# EAGLE design gdoor (EAGLE 9.2.2)
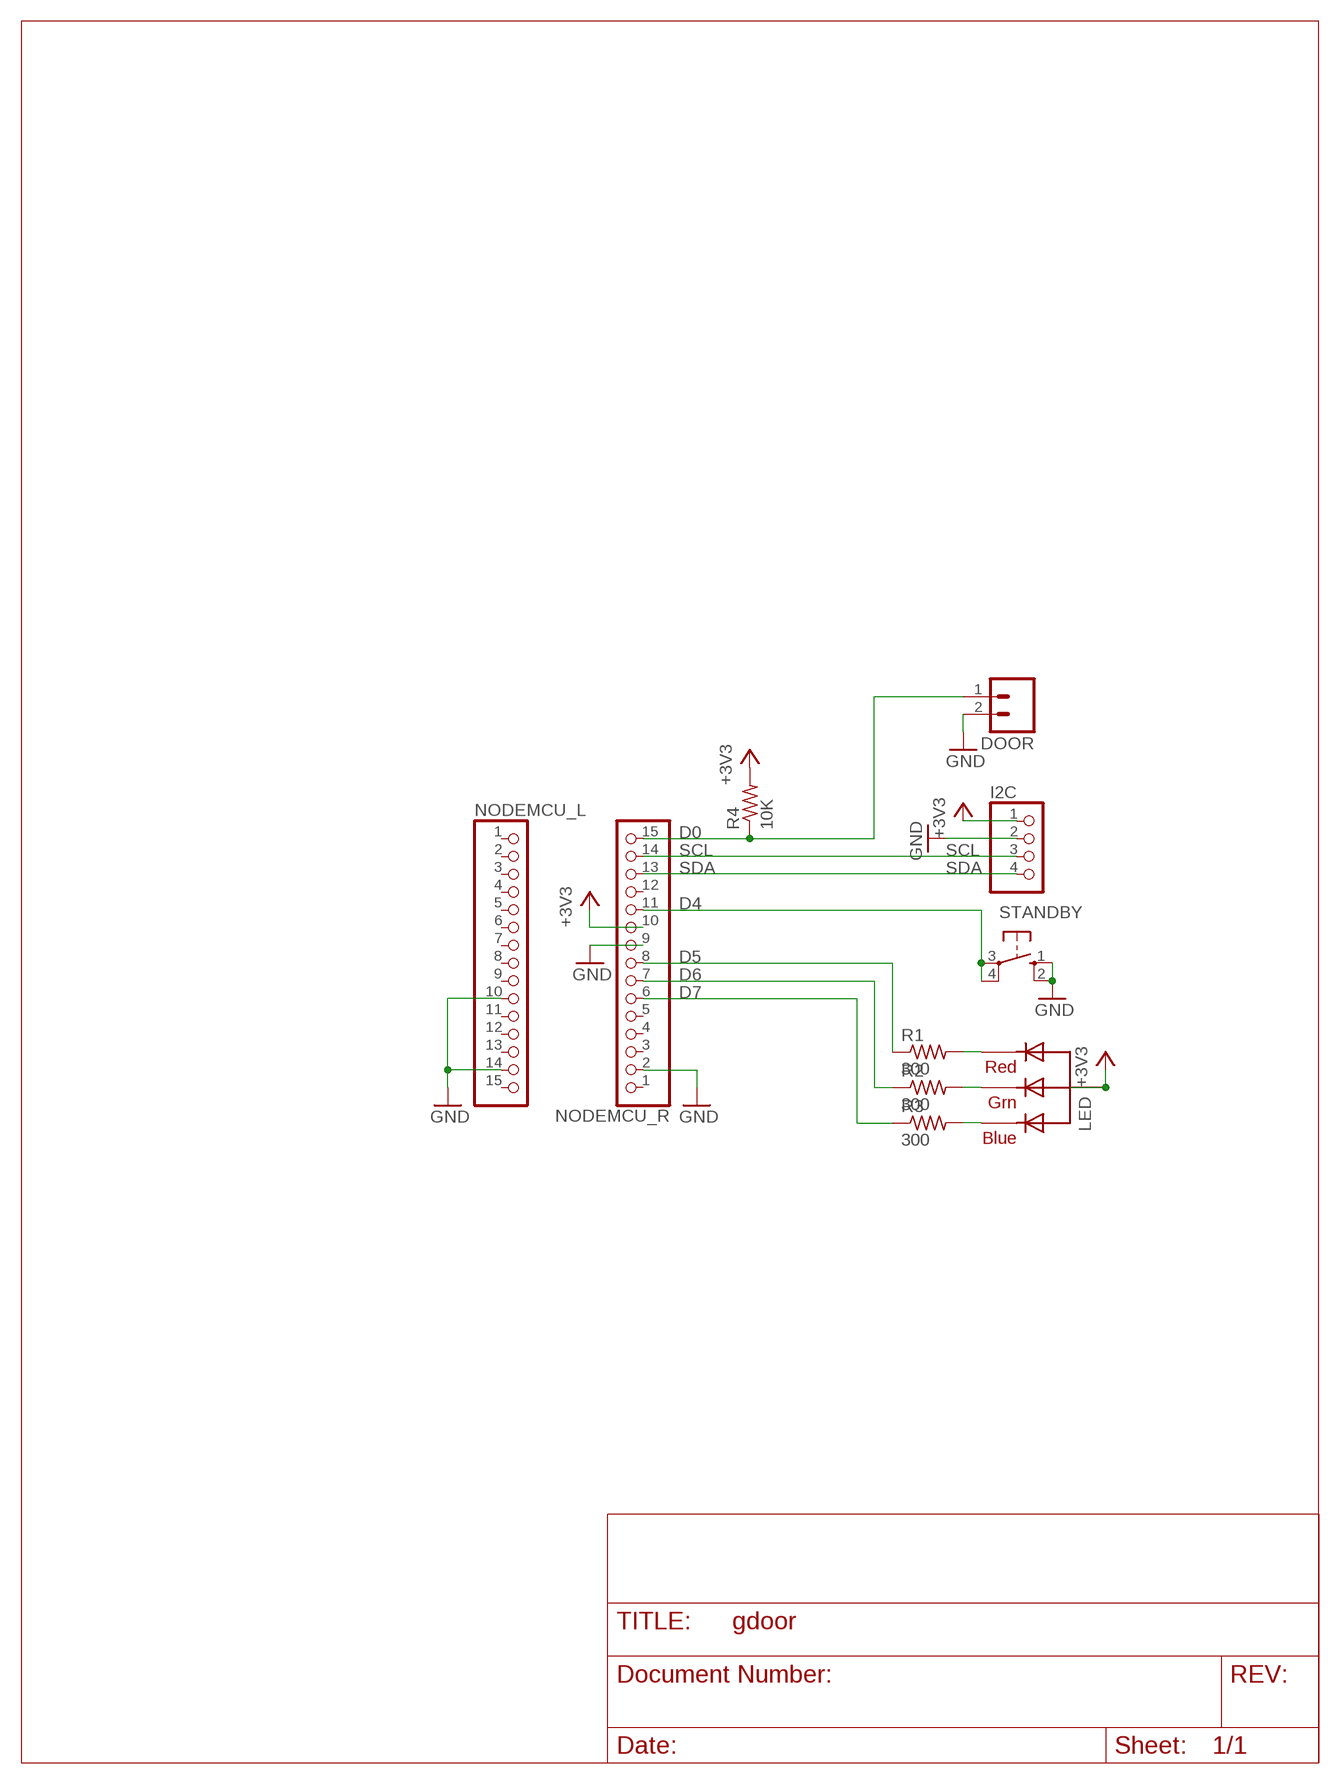
[diagram p0: schematic, sheet 1]

## Parts
DOOR  M025MM  [SCREWTERMINAL-5MM-2]
I2C  PINHD-1X4  [1X04]
LED  RGBLED_CA-5MM  [LED5MMRGB]
NODEMCU_L  PINHD-1X15  [1X15]
NODEMCU_R  PINHD-1X15  [1X15]
R1  300  R-US_0207/10  [0207/10]
R2  300  R-US_0207/10  [0207/10]
R3  300  R-US_0207/10  [0207/10]
R4  10K  R-US_0207/10  [0207/10]
STANDBY  10-XX  [B3F-10XX]

## Nets
+3V3: I2C.1 LED.2(VCC) NODEMCU_R.10 R4.2
BLUE: LED.4(BLUE) R3.2
D0: DOOR.1 NODEMCU_R.15 R4.1
D4: NODEMCU_R.11 STANDBY.3(P) STANDBY.4(P1)
D5: NODEMCU_R.8 R1.1
D6: NODEMCU_R.7 R2.1
D7: NODEMCU_R.6 R3.1
GND: DOOR.2 I2C.2 NODEMCU_L.10 NODEMCU_L.14 NODEMCU_R.2 NODEMCU_R.9 STANDBY.1(S) STANDBY.2(S1)
GRN: LED.3(GREEN) R2.2
RED: LED.1(RED) R1.2
SCL: I2C.3 NODEMCU_R.14
SDA: I2C.4 NODEMCU_R.13
Unconnected: NODEMCU_L.1 NODEMCU_L.2 NODEMCU_L.3 NODEMCU_L.4 NODEMCU_L.5 NODEMCU_L.6 NODEMCU_L.7 NODEMCU_L.8 NODEMCU_L.9 NODEMCU_L.11 NODEMCU_L.12 NODEMCU_L.13 NODEMCU_L.15 NODEMCU_R.1 NODEMCU_R.3 NODEMCU_R.4 NODEMCU_R.5 NODEMCU_R.12

## Library data of the parts
DOOR = SparkFun-Connectors:M02: Standard 2-pin 0.1" header. Use with - straight break away headers ( PRT-00116) - right angle break away headers (PRT-00553) - swiss pins (PRT-00743) - machine pins (PRT-00117) - female headers (PRT-00115) Molex polarized connector foot print use with: PRT-08233 with associated crimp pins and housings. 2.54_SCREWTERM for use with PRT-10571. 3.5mm Screw Terminal footprints for PRT-08084 5mm Screw Terminal footprints for use with PRT-08432; STOREFRONT_ID: PRT-08432
I2C = pinhead:PINHD-1X4: PIN HEADER
LED = adafruit:RGBLED_CA: RGB LED, common-anode 5MM Staggered pins 5mm Piranha package http://www.ladyada.net/library/pcb/eaglelibrary.html
NODEMCU_L NODEMCU_R = pinhead:PINHD-1X15: PIN HEADER
R1-R4 = resistor:R-US_: RESISTOR, American symbol
STANDBY = switch-omron:10-XX: OMRON SWITCH; MPN: B3F-1000; OC_FARNELL: 176432; OC_NEWARK: 36M3542

## Board
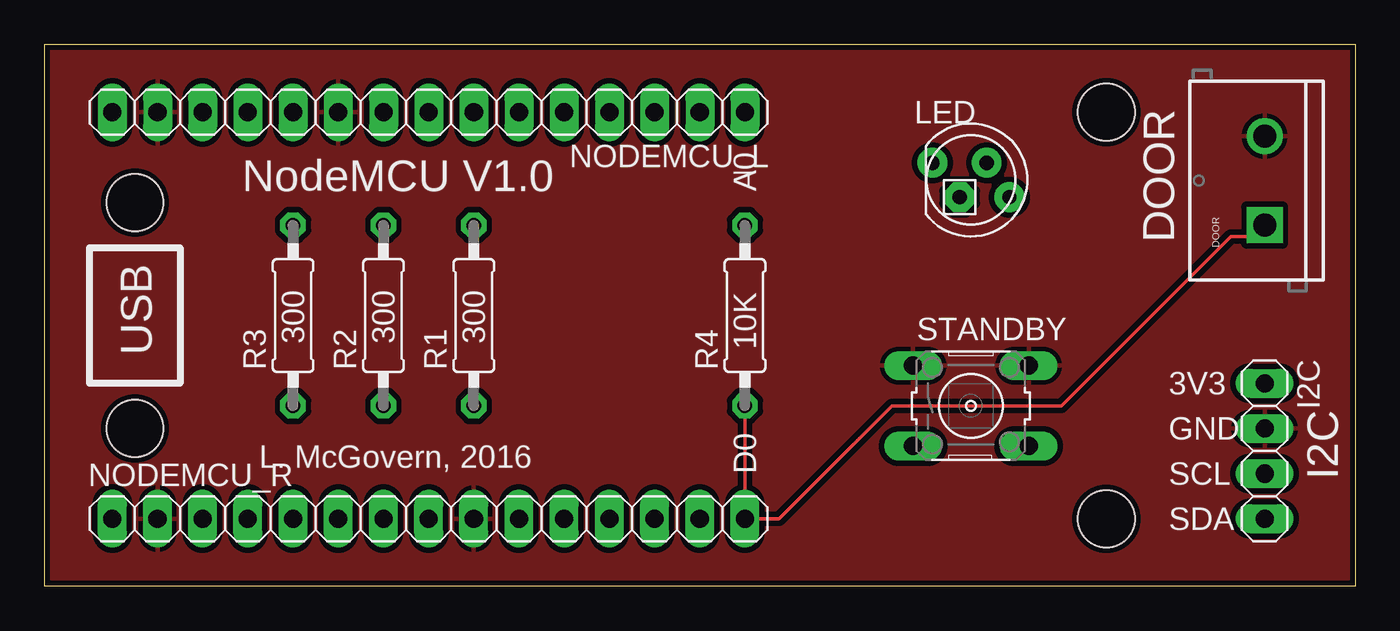
[diagram p1: board, top side]
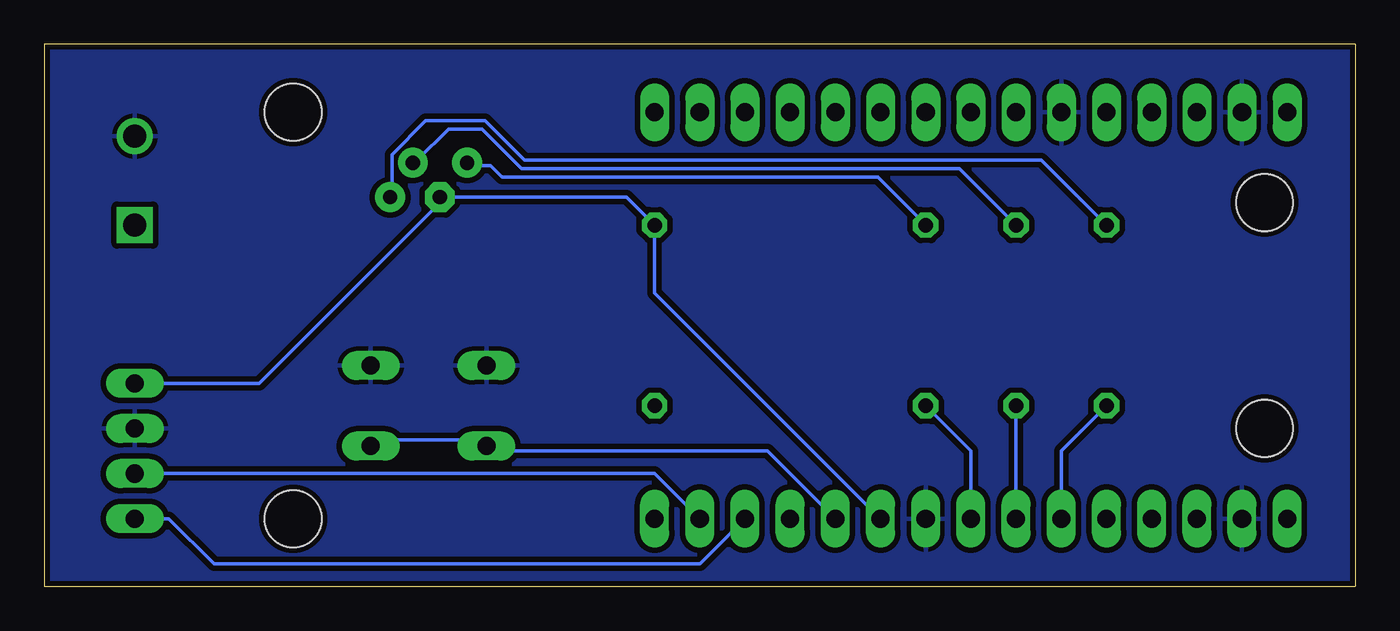
[diagram p2: board, bottom side, seen from below]

Size 73.66 x 30.48 mm. Coordinates in mm from the lower left corner, seen from the top.
Outline: 0,30.48 73.66,30.48 73.66,0 0,0 0,30.48
Copper layers (1*16): Top 0.035mm / dielectric 1.5mm / Bottom 0.035mm
Design rules "SparkFun": minimum track width 8mil, minimum drill 20mil, track to track 8mil, track to pad 8mil, pad to pad 8mil, via to via 8mil, smd to smd 8mil, copper to edge 8mil, drill to drill 8mil, minimum pad ring 12mil, minimum via ring 10mil, stop-mask expansion 4mil, vias tented up to drill 20mil, thermal gap 10mil
Holes 3.2 mm at 5.08,21.59 5.08,8.89 59.69,3.81 59.69,26.67

### Footprints (pad centres in the part's own frame; a part is rotated, then mirrored left to right if it is on the bottom)
SCREWTERMINAL-5MM-2 = drill 1.3 pad 2.032 square: 1 0,0 | drill 1.3 pad 2.032: 2 5,0
1X04 = drill 1.016 long: 1 -3.81,0; 2 -1.27,0; 3 1.27,0; 4 3.81,0
LED5MMRGB = drill 0.8 pad 1.676: 1 -2.159,0.968; 3 0.889,0.968; 4 2.159,-0.968 | drill 0.8 pad 1.676 octagon: 2 -0.635,-0.968
1X15 = drill 1.016 long: 1 -17.78,0; 2 -15.24,0; 3 -12.7,0; 4 -10.16,0; 5 -7.62,0; 6 -5.08,0; 7 -2.54,0; 8 0,0; 9 2.54,0; 10 5.08,0; 11 7.62,0; 12 10.16,0; 13 12.7,0; 14 15.24,0; 15 17.78,0
0207/10 = drill 0.813 octagon: 1 -5.08,0; 2 5.08,0
B3F-10XX = drill 1.016 long: 1 -3.251,2.261; 2 3.251,2.261; 3 -3.251,-2.261; 4 3.251,-2.261

### Placement (x,y rotation side)
DOOR  68.58,20.32 90 top
I2C  68.58,7.62 270 top
LED  52.07,22.86 0 top
NODEMCU_L  21.59,26.67 180 top
NODEMCU_R  21.59,3.81 0 top
R1  24.13,15.24 90 top
R2  19.05,15.24 90 top
R3  13.97,15.24 90 top
R4  39.37,15.24 90 top
STANDBY  52.07,10.16 0 top

### Tracks (layer width: path | path; a pad name or v marks a point on that pad's centre or on a via)
+3V3
  Bottom 0.203: I2C.1 61.59,11.43 51.44,21.59 LED.2 40.94,21.89 R4.2 39.37,16.51 NODEMCU_R.10
BLUE
  Bottom 0.203: R3.2 17.62,23.97 46.67,23.97 48.9,26.19 52.23,26.19 54.13,24.29 54.13,21.91 LED.4
D0
  Top 0.203: DOOR.1 67.94,19.68 66.67,19.68 57.15,10.16 47.62,10.16 41.27,3.81 NODEMCU_R.15 R4.1
D4
  Bottom 0.203: NODEMCU_R.11 33.02,7.62 48.26,7.62 STANDBY.3 48.9,8.26 55.24,8.26 STANDBY.4
D5
  Bottom 0.203: R1.1 21.59,7.62 NODEMCU_R.8
D6
  Bottom 0.203: NODEMCU_R.7 R2.1
D7
  Bottom 0.203: R3.1 16.51,7.62 NODEMCU_R.6
GND
  pour Top (isolate 0.305): 0,0 0,30.48 73.66,30.48 73.66,0
  pour Bottom (isolate 0.305): 0,0 0,30.48 73.66,30.48 73.66,0
GRN
  Bottom 0.203: R2.2 22.23,23.5 46.83,23.5 49.05,25.72 50.96,25.72 52.7,23.97 52.86,23.97 LED.3
RED
  Bottom 0.203: R1.2 26.83,23.02 47.94,23.02 48.58,23.65 49.69,23.65 49.85,23.81 LED.1
SCL
  Bottom 0.203: NODEMCU_R.14 39.37,6.35 I2C.3
SDA
  Bottom 0.203: NODEMCU_R.13 36.83,1.27 64.14,1.27 66.67,3.81 I2C.4

### Text on the board
tPlace: NodeMCU V1.0 | A0 | DOOR | 300 | 300 | 300 | USB | 10K | 3V3 | GND | L. McGovern, 2016 | D0 | SCL | I2C | SDA